# Altium project hall4poles.PrjPcb
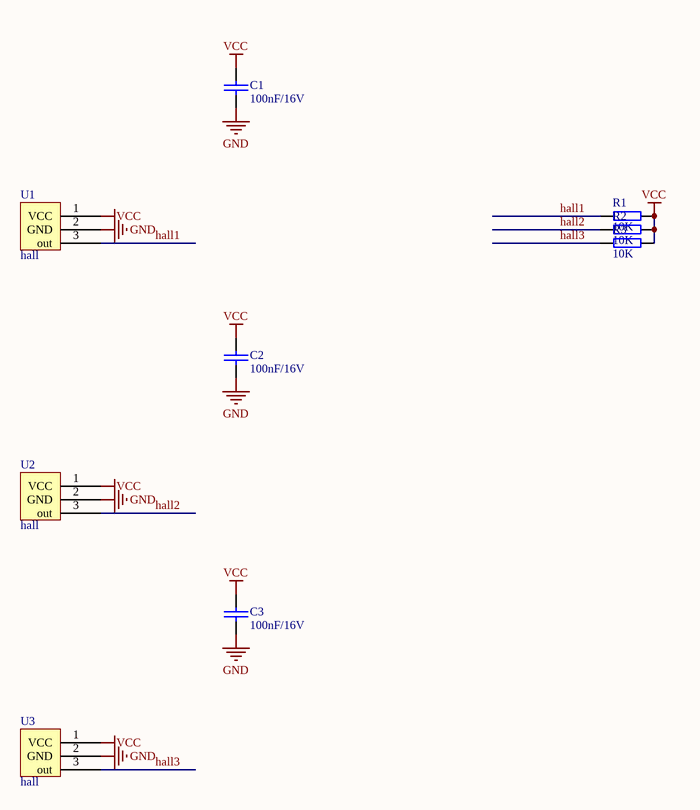
[diagram p0: hall4poles.SchDoc]
1 sheet, 9 parts. Net scope: global (net labels, ports and power ports of the same name join across sheets).
Board file: hall4poles.PcbDoc

## Sheet hall4poles.SchDoc
size A4

### Parts
C1  100nF/16V  [C0603]
C2  100nF/16V  [C0603]
C3  100nF/16V  [C0603]
R1  10K  [R0603]
R2  10K  [R0603]
R3  10K  [R0603]
U1  hall  [TO-92S]
U2  hall  [TO-92S]
U3  hall  [TO-92S]

### Nets
GND: C1.1 C2.1 C3.1 U1.2(GND) U2.2(GND) U3.2(GND)
VCC: C1.2 C2.2 C3.2 R1.2 R2.2 R3.2 U1.1(VCC) U2.1(VCC) U3.1(VCC)
hall1: R1.1 U1.3(out)
hall2: R2.1 U2.3(out)
hall3: R3.1 U3.3(out)

### Library data of the parts
C1-C3 = CAP: Capacitor
R1-R3 = Resistance